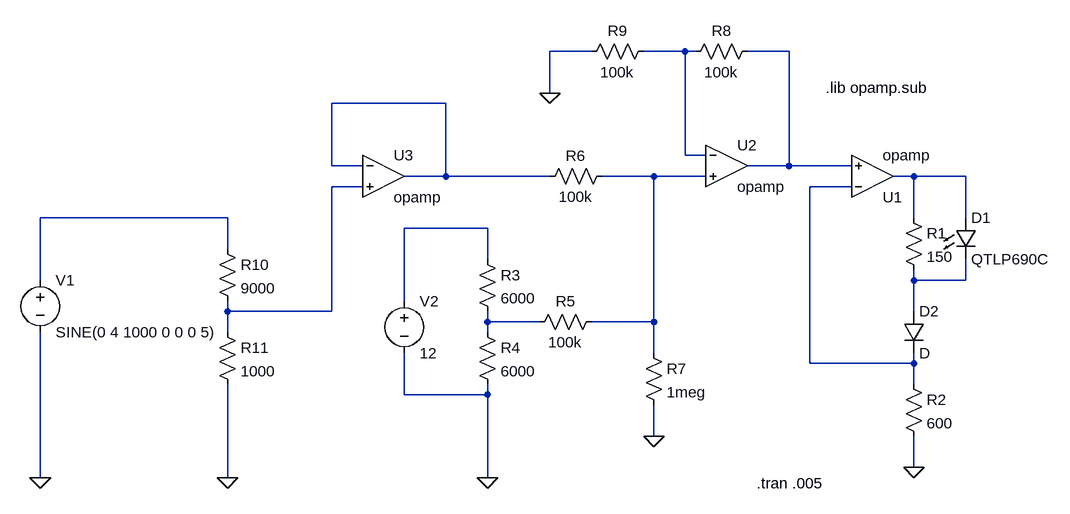
[diagram p0: schematic optopart.asc]
optopart.asc, the LTspice schematic file:
Version 4
SHEET 1 880 688
WIRE -688 -96 -752 -96
WIRE -544 -96 -608 -96
WIRE -528 -96 -544 -96
WIRE -384 -96 -448 -96
WIRE -752 -32 -752 -96
WIRE -912 -16 -1088 -16
WIRE -544 64 -544 -96
WIRE -512 64 -544 64
WIRE -1088 80 -1088 -16
WIRE -1040 80 -1088 80
WIRE -384 80 -384 -96
WIRE -384 80 -448 80
WIRE -288 80 -384 80
WIRE -912 96 -912 -16
WIRE -912 96 -976 96
WIRE -752 96 -912 96
WIRE -592 96 -672 96
WIRE -512 96 -592 96
WIRE -192 96 -224 96
WIRE -112 96 -192 96
WIRE -1040 112 -1088 112
WIRE -288 112 -352 112
WIRE -1248 160 -1536 160
WIRE -192 160 -192 96
WIRE -112 160 -112 96
WIRE -848 176 -976 176
WIRE -1248 208 -1248 160
WIRE -848 224 -848 176
WIRE -1536 256 -1536 160
WIRE -192 256 -192 240
WIRE -112 256 -112 224
WIRE -112 256 -192 256
WIRE -976 288 -976 176
WIRE -1248 304 -1248 288
WIRE -1088 304 -1088 112
WIRE -1088 304 -1248 304
WIRE -192 304 -192 256
WIRE -848 320 -848 304
WIRE -768 320 -848 320
WIRE -592 320 -592 96
WIRE -592 320 -688 320
WIRE -1248 336 -1248 304
WIRE -848 336 -848 320
WIRE -592 368 -592 320
WIRE -352 384 -352 112
WIRE -192 384 -192 368
WIRE -192 384 -352 384
WIRE -192 416 -192 384
WIRE -976 432 -976 368
WIRE -848 432 -848 416
WIRE -848 432 -976 432
WIRE -592 496 -592 448
WIRE -192 544 -192 496
WIRE -1536 560 -1536 336
WIRE -1248 560 -1248 416
WIRE -848 560 -848 432
FLAG -1536 560 0
FLAG -192 544 0
FLAG -848 560 0
FLAG -592 496 0
FLAG -752 -32 0
FLAG -1248 560 0
SYMBOL Opamps\\opamp -256 160 M180
SYMATTR InstName U1
SYMBOL LED -128 160 R0
SYMATTR InstName D1
SYMATTR Value QTLP690C
SYMATTR Description Diode
SYMATTR Type diode
SYMBOL diode -208 304 R0
SYMATTR InstName D2
SYMBOL res -208 144 R0
SYMATTR InstName R1
SYMATTR Value 150
SYMBOL voltage -1536 240 R0
WINDOW 123 0 0 Left 2
WINDOW 39 0 0 Left 2
SYMATTR InstName V1
SYMATTR Value SINE(0 4 1000 0 0 0 5)
SYMBOL res -208 400 R0
SYMATTR InstName R2
SYMATTR Value 600
SYMBOL Opamps\\opamp -480 16 R0
SYMATTR InstName U2
SYMBOL res -864 208 R0
SYMATTR InstName R3
SYMATTR Value 6000
SYMBOL res -864 320 R0
SYMATTR InstName R4
SYMATTR Value 6000
SYMBOL res -672 304 R90
WINDOW 0 0 56 VBottom 2
WINDOW 3 32 56 VTop 2
SYMATTR InstName R5
SYMATTR Value 100k
SYMBOL res -656 80 R90
WINDOW 0 0 56 VBottom 2
WINDOW 3 32 56 VTop 2
SYMATTR InstName R6
SYMATTR Value 100k
SYMBOL voltage -976 272 R0
WINDOW 123 0 0 Left 2
WINDOW 39 0 0 Left 2
SYMATTR InstName V2
SYMATTR Value 12
SYMBOL res -608 352 R0
SYMATTR InstName R7
SYMATTR Value 1meg
SYMBOL res -432 -112 R90
WINDOW 0 0 56 VBottom 2
WINDOW 3 32 56 VTop 2
SYMATTR InstName R8
SYMATTR Value 100k
SYMBOL res -592 -112 R90
WINDOW 0 0 56 VBottom 2
WINDOW 3 32 56 VTop 2
SYMATTR InstName R9
SYMATTR Value 100k
SYMBOL Opamps\\opamp -1008 32 R0
SYMATTR InstName U3
SYMBOL res -1264 192 R0
SYMATTR InstName R10
SYMATTR Value 9000
SYMBOL res -1264 320 R0
SYMATTR InstName R11
SYMATTR Value 1000
TEXT -328 -40 Left 2 !.lib opamp.sub
TEXT -434 568 Left 2 !.tran .005

The netlist it stands for:
* optopart.asc
XU1 N007 N002 N005 opamp Aol=100K GBW=10Meg  ; pins invin noninvin out
D1 N005 N010 QTLP690C
D2 N010 N007 D
R1 N005 N010 150
V1 N008 0 SINE(0 4 1000 0 0 0 5)
R2 N007 0 600
XU2 N001 N004 N002 opamp Aol=100K GBW=10Meg  ; pins invin noninvin out
R3 N009 N011 6000
R4 N011 0 6000
R5 N004 N011 100k
R6 N004 N003 100k
V2 N009 0 12
R7 N004 0 1meg
R8 N002 N001 100k
R9 N001 0 100k
XU3 N003 N006 N003 opamp Aol=100K GBW=10Meg  ; pins invin noninvin out
R10 N008 N006 9000
R11 N006 0 1000
.model D D
.lib standard.dio
.lib opamp.sub
.tran .005
.backanno
.end